# EAGLE design Pi1541_Switch (EAGLE 9.2.2)
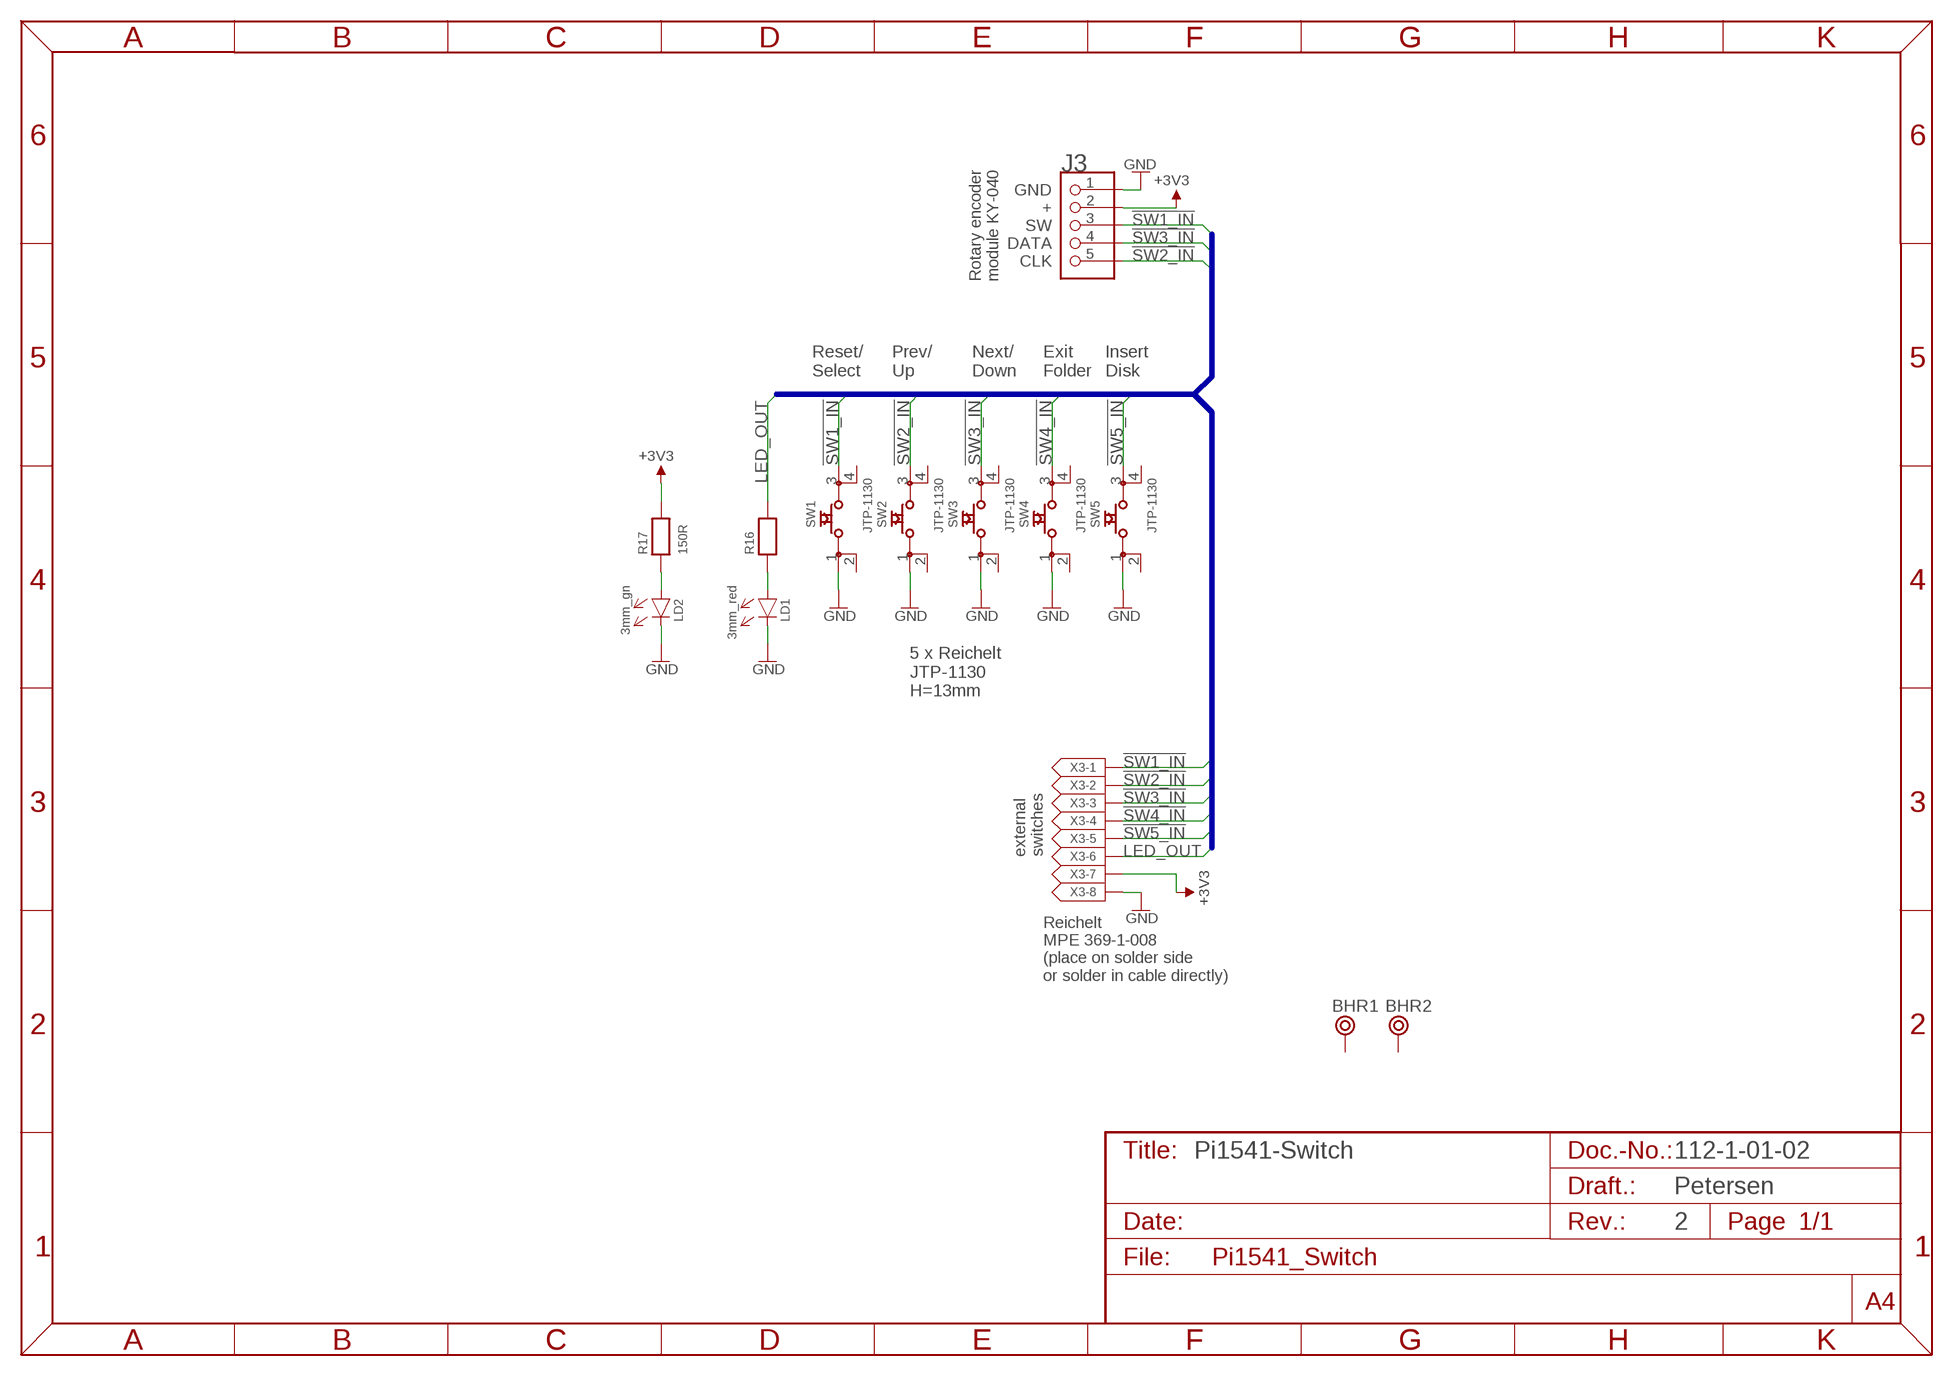
[diagram p0: schematic, sheet 1]

## Parts
BHR1  BOHR2,8  [BOHR2,8_]
BHR2  BOHR2,8  [BOHR2,8_]
J3  PINHD-1X5  [1X05]
LD1  3mm_red  3MM  [3MM]
LD2  3mm_gn  3MM  [3MM]
R16  150R  R-0805  [0805]
R17  150R  R-0805  [0805]
SW1  JTP-1130  [JTP-1130]
SW2  JTP-1130  [JTP-1130]
SW3  JTP-1130  [JTP-1130]
SW4  JTP-1130  [JTP-1130]
SW5  JTP-1130  [JTP-1130]
X3  MICMA08B  [MICMA08B]

## Nets
!SW1_IN: J3.3 SW1.3 X3.1
!SW2_IN: J3.5 SW2.3 X3.2
!SW3_IN: J3.4 SW3.3 X3.3
!SW4_IN: SW4.3 X3.4
!SW5_IN: SW5.3 X3.5
+3V3: J3.2 R17.2 X3.7
GND: J3.1 LD1.C(K) LD2.C(K) SW1.1 SW2.1 SW3.1 SW4.1 SW5.1 X3.8
LED_OUT: R16.2 X3.6
N$7: LD2.A R17.1
N$12: LD1.A R16.1
Unconnected: BHR1.MH BHR2.MH SW1.2 SW1.4 SW2.2 SW2.4 SW3.2 SW3.4 SW4.2 SW4.4 SW5.2 SW5.4

## Buses
RASPI_SIG:ATN_IN,CE0,CE1,CLK_IN,!CLK_OUT,DATA_IN,!DATA_OUT,ID_SC,ID_SD,LED_OUT,MISO,MOSI,!RESET_IN,SCL,SCLK,SDA,SND_OUT,!SQR_OUT,!SW1_IN,!SW2_IN,!SW3_IN,!SW4_IN,!SW5_IN

## Notes on the sheet
- GND
- +
- Rotary encoder
  module KY-040
- SW
- DATA
- CLK
- Reset/
  Select
- Prev/
  Up
- Next/
  Down
- Exit
  Folder
- Insert
  Disk
- 5 x Reichelt
  JTP-1130
  H=13mm
- external
  switches
- Reichelt
  MPE 369-1-008
  (place on solder side
  or solder in cable directly)
- Pi1541-Switch | 112-1-01-02
- Petersen
- 2

## Library data of the parts
BHR1 BHR2 = Mech_Bohr:BOHR2,8
J3 = PINHEAD:PINHD-1X5
LD1 LD2 = LED:3MM
R16 R17 = SMD:R-0805
SW1-SW5 = Namae_Electronics:JTP-1130
X3 = AMP:MICMA08B

## Board
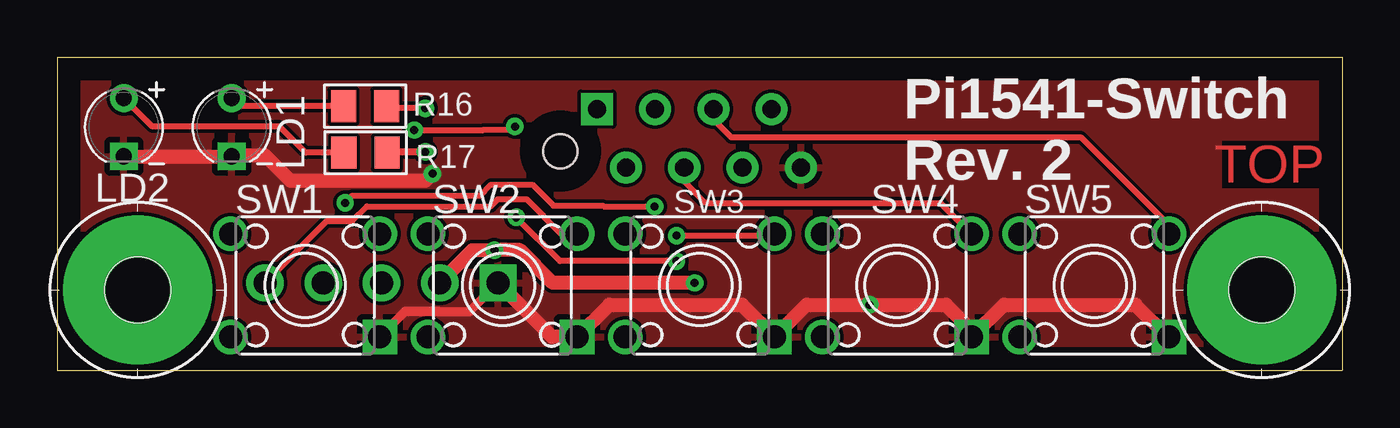
[diagram p1: board, top side]
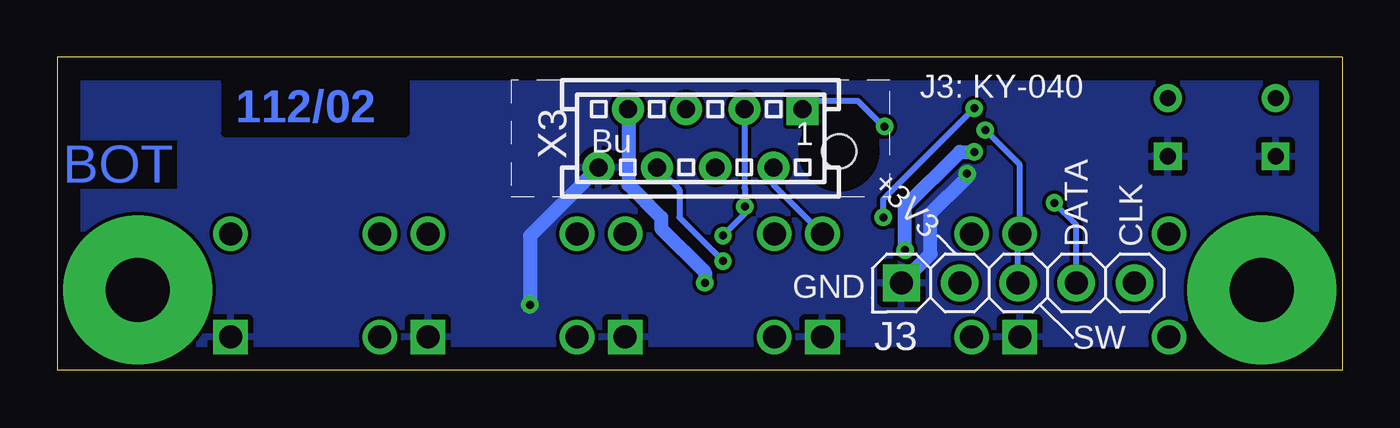
[diagram p2: board, bottom side, seen from below]

Size 56 x 13.65 mm. Coordinates in mm from the lower left corner, seen from the top.
Outline: 0,0 56,0 56,13.65 0,13.65 0,0
Copper layers (1*16): Top 0.035mm / dielectric 1.5mm / Bottom 0.035mm
Design rules "default *": minimum track width 6mil, minimum drill 0.35mm, track to track 6mil, track to pad 6mil, pad to pad 6mil, via to via 6mil, smd to smd 6mil, copper to edge 40mil, drill to drill 6mil, minimum pad ring 10mil, minimum via ring 8mil, stop-mask expansion 4mil, vias tented up to drill 0.5mm, thermal gap 10mil
bRestrict: 3 lines

### Footprints (pad centres in the part's own frame; a part is rotated, then mirrored left to right if it is on the bottom)
BOHR2,8_ = drill 2.794 pad 6.502: MH 0,0
1X05 = drill 1 pad 1.626 square: 1 -5.08,0 | drill 1 pad 1.626: 2 -2.54,0; 3 0,0; 4 2.54,0; 5 5.08,0
3MM = drill 0.7: A -1.27,0 | drill 0.7 square: C 1.27,0
0805 = smd 1.092 x 1.397: 1 -0.94,0; 2 0.94,0
JTP-1130 = drill 1 square: 1 3.25,-2.25 | drill 1: 2 -3.25,-2.25; 3 3.25,2.25; 4 -3.25,2.25
MICMA08B = drill 0.787 pad 1.397 square: 1 4.445,1.27 | drill 0.787 pad 1.397: 2 3.175,-1.27; 3 1.905,1.27; 4 0.635,-1.27; 5 -0.635,1.27; 6 -1.905,-1.27; 7 -3.175,1.27; 8 -4.445,-1.27 | hole 1.5: 6.032,-0.568

### Placement (x,y rotation side)
BHR1  3.5,3.5 0 top
BHR2  52.5,3.5 0 top
J3  14.13,3.81 0 bottom
LD1  7.6,10.6 270 top
LD2  2.9,10.6 270 top
R16  13.41,11.52 0 top
R17  13.43,9.49 0 top
SW1  10.8,3.7 0 top
SW2  19.4,3.7 0 top
SW3  28,3.7 0 top
SW4  36.6,3.7 0 top
SW5  45.2,3.7 0 top
U$44  [2LAYER]  55.24,9.84 180 top
U$45  [PCB-TITLE/]  0.16,27.93 0 top  (outside the outline)
X3  27.96,10.12 0 bottom

### Tracks (layer width: path | path; a pad name or v marks a point on that pad's centre or on a via)
!SW1_IN  (via drill 0.35)
  Top 0.254: v19.94,10.64 19.78,10.48 18.58,10.48 v15.56,10.48
  Bottom 0.254: v19.94,10.64 20,10.64 21.11,11.75 23.16,11.75 X3.1 | J3.3 14.13,5.87 SW1.3 14.05,8.97 v15.56,10.48
!SW2_IN
  Top 0.254: J3.5 11.75,6.51 12.86,6.51 13.49,7.14 18.89,7.14 19.21,7.46 20.45,7.46 21.96,5.95 SW2.3
  Bottom 0.254: SW2.3 24.79,8.09 X3.2
!SW3_IN  (via drill 0.35)
  Top 0.254: v26.99,5.87 31.17,5.87 SW3.3 | v12.54,7.3 12.86,7.62 18.41,7.62 18.89,8.1 20.71,8.1 21.62,7.18 23.77,7.18 23.81,7.14 v26.04,7.14
  Bottom 0.254: X3.3 26.05,7.96 26.04,7.94 v26.04,7.14 26.04,6.83 v26.99,5.87 | J3.4 11.59,6.35 v12.54,7.3
!SW4_IN
  Top 0.254: X3.4 27.32,8.23 28.26,7.3 38.5,7.3 SW4.3
!SW5_IN
  Top 0.254: SW5.3 48.42,5.95 48.42,6.35 44.61,10.16 29.37,10.16 28.59,10.93 X3.5
+3V3  (via drill 0.35)
  Top 0.305: v16.03,9.53 14.4,9.53 R17.2
  Top 0.61: v27.78,3.81 21.59,3.81 20.16,5.24 v19.05,5.24 18.1,5.24 J3.2
  Bottom 0.61: v19.05,5.24 19.05,7.14 16.67,9.53 v16.03,9.53 | X3.7 31.11,11.37 31.11,8.1 29.69,6.67 29.69,6.19 27.78,4.29 v27.78,3.81
GND  (via drill 0.35)
  Top 0.406: SW1.1 15.16,2.56 16.61,2.56 16.63,2.54 17.94,2.54 J3.1
  Top 0.61: LD2.C LD1.C 7.64,9.37 9.05,9.37 10.16,8.26 16.03,8.26 v16.35,8.57 | SW5.1 48.4,1.45 46.99,2.86 41.26,2.86 SW4.1 39.85,1.74 38.73,2.86 v35.4,2.86 32.66,2.86 SW3.1 29.84,2.86 24.06,2.86 SW2.1 21.57,1.45 J3.1
  Bottom 0.61: X3.8 35.4,5.85 v35.4,2.86 | J3.1 17.94,5.08 17.94,6.83 16.27,8.49 v16.35,8.57
  pour Top: 0.48,13.29 0.48,0.48 55.56,0.48 55.56,13.29
  pour Bottom: 0.48,13.29 55.56,13.29 55.56,0.48 0.48,0.48
LED_OUT  (via drill 0.35)
  Top 0.254: v26.99,4.76 21.91,4.76 v20,6.67 | v16.03,11.43 14.44,11.43 R16.2
  Bottom 0.254: v20,6.67 20,7.46 v16.03,11.43 | X3.6 28.89,7.88 28.89,6.67 v26.99,4.76
N$7
  Top 0.254: R17.1 10.83,9.49 9.68,10.64 4.13,10.64 LD2.A
N$12
  Top 0.254: R16.1 7.95,11.52 LD1.A

### Text on the board
Bottom: 112/02
tPlace: Pi1541-Switch / Rev. 2
bPlace: J3: KY-040 | +3V3 | CLK | DATA | GND | SW
Document: 112-2-01-02 | Sven Petersen / 2019 | 35µm | 2 | 2